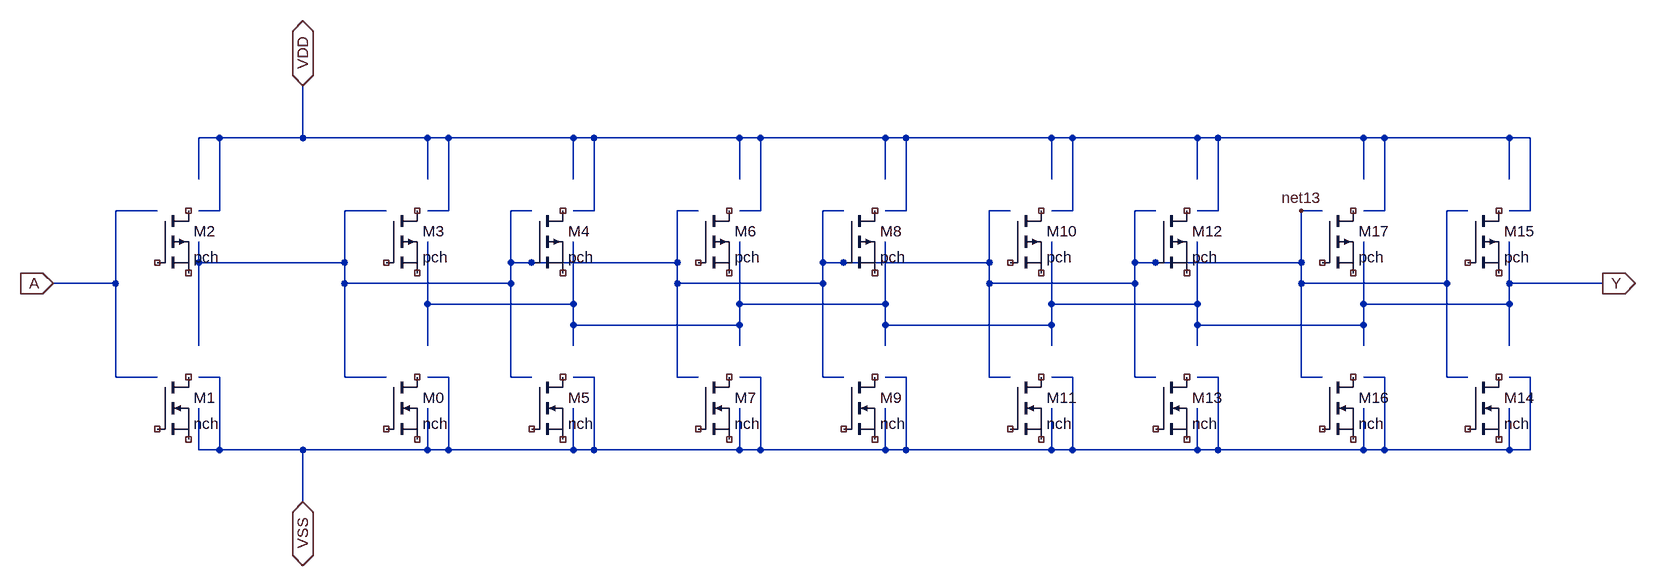
[diagram p0: schematic buf8.asc]
buf8.asc, the LTspice schematic file:
Version 4
SHEET 1 2560 832
WIRE 192 544 192 400
WIRE 96 400 192 400
WIRE 192 400 192 288
WIRE 192 288 256 288
WIRE 192 544 256 544
WIRE 2016 544 2016 400
WIRE 1760 368 1760 288
WIRE 2016 368 2016 288
WIRE 2016 288 2048 288
WIRE 2016 400 2016 368
WIRE 2016 544 2048 544
WIRE 2240 400 2240 288
WIRE 2240 288 2272 288
WIRE 2240 544 2272 544
WIRE 2240 544 2240 400
WIRE 1760 368 2016 368
WIRE 2016 400 2240 400
WIRE 1536 544 1536 400
WIRE 1280 368 1280 288
WIRE 1536 368 1536 288
WIRE 1536 288 1568 288
WIRE 1536 400 1536 368
WIRE 1536 544 1568 544
WIRE 1760 400 1760 368
WIRE 1760 288 1792 288
WIRE 1760 544 1792 544
WIRE 1760 544 1760 400
WIRE 1280 368 1536 368
WIRE 1056 400 1280 400
WIRE 1056 544 1056 400
WIRE 1280 400 1280 368
WIRE 1536 400 1760 400
WIRE 1280 288 1312 288
WIRE 1280 544 1312 544
WIRE 1280 544 1280 400
WIRE 320 496 320 368
WIRE 544 400 544 368
WIRE 800 288 832 288
WIRE 800 544 832 544
WIRE 1056 368 1056 288
WIRE 800 368 800 288
WIRE 800 368 1056 368
WIRE 1056 288 1088 288
WIRE 1056 400 1056 368
WIRE 1056 544 1088 544
WIRE 800 400 800 368
WIRE 544 400 800 400
WIRE 544 544 544 400
WIRE 800 544 800 400
WIRE 544 288 608 288
WIRE 320 368 320 336
WIRE 544 544 608 544
WIRE 544 368 544 288
WIRE 320 368 544 368
WIRE 2336 400 2336 336
WIRE 2112 432 2112 336
WIRE 2112 464 2112 432
WIRE 2112 496 2112 464
WIRE 1856 464 1856 432
WIRE 2336 432 2336 400
WIRE 2336 496 2336 432
WIRE 1632 432 1856 432
WIRE 1632 432 1632 336
WIRE 1632 464 1632 432
WIRE 1632 496 1632 464
WIRE 1856 464 2112 464
WIRE 1376 464 1376 432
WIRE 1856 432 1856 336
WIRE 2112 432 2336 432
WIRE 1856 496 1856 464
WIRE 1376 432 1376 336
WIRE 1152 432 1152 336
WIRE 1152 432 1376 432
WIRE 896 464 1152 464
WIRE 896 496 896 464
WIRE 1152 464 1152 432
WIRE 1152 496 1152 464
WIRE 1376 496 1376 464
WIRE 672 432 672 336
WIRE 672 432 896 432
WIRE 896 432 896 336
WIRE 896 464 896 432
WIRE 2336 400 2480 400
WIRE 672 496 672 432
WIRE 1376 464 1632 464
WIRE 2144 656 2336 656
WIRE 1888 656 2112 656
WIRE 1664 656 1856 656
WIRE 1408 656 1632 656
WIRE 2112 656 2144 656
WIRE 2144 656 2144 544
WIRE 2112 544 2144 544
WIRE 2112 656 2112 592
WIRE 2336 656 2368 656
WIRE 2368 656 2368 544
WIRE 2336 544 2368 544
WIRE 2336 656 2336 592
WIRE 1632 656 1664 656
WIRE 1664 656 1664 544
WIRE 1632 544 1664 544
WIRE 1632 656 1632 592
WIRE 1856 656 1888 656
WIRE 1888 656 1888 544
WIRE 1856 544 1888 544
WIRE 1856 656 1856 592
WIRE 928 656 1152 656
WIRE 1184 656 1376 656
WIRE 1152 656 1184 656
WIRE 1184 656 1184 544
WIRE 1152 544 1184 544
WIRE 1152 656 1152 592
WIRE 1376 656 1408 656
WIRE 1408 656 1408 544
WIRE 1376 544 1408 544
WIRE 1376 656 1376 592
WIRE 704 656 896 656
WIRE 896 656 928 656
WIRE 928 656 928 544
WIRE 896 544 928 544
WIRE 896 656 896 592
WIRE 480 656 480 736
WIRE 480 656 672 656
WIRE 352 656 352 544
WIRE 352 656 480 656
WIRE 320 544 352 544
WIRE 672 656 704 656
WIRE 704 656 704 544
WIRE 672 544 704 544
WIRE 672 656 672 592
WIRE 320 656 352 656
WIRE 320 656 320 592
WIRE 2144 176 2336 176
WIRE 1888 176 2112 176
WIRE 1664 176 1856 176
WIRE 1408 176 1632 176
WIRE 2112 176 2144 176
WIRE 2144 288 2144 176
WIRE 2112 288 2144 288
WIRE 2112 240 2112 176
WIRE 2336 176 2368 176
WIRE 2368 288 2368 176
WIRE 2336 288 2368 288
WIRE 2336 240 2336 176
WIRE 1632 176 1664 176
WIRE 1664 288 1664 176
WIRE 1632 288 1664 288
WIRE 1632 240 1632 176
WIRE 1856 176 1888 176
WIRE 1888 288 1888 176
WIRE 1856 288 1888 288
WIRE 1856 240 1856 176
WIRE 1152 176 1184 176
WIRE 1184 288 1184 176
WIRE 1152 288 1184 288
WIRE 1152 240 1152 176
WIRE 1376 176 1408 176
WIRE 1408 288 1408 176
WIRE 1376 288 1408 288
WIRE 1376 240 1376 176
WIRE 1184 176 1376 176
WIRE 704 176 896 176
WIRE 896 176 928 176
WIRE 928 176 1152 176
WIRE 928 288 928 176
WIRE 896 288 928 288
WIRE 896 240 896 176
WIRE 480 96 480 176
WIRE 480 176 672 176
WIRE 672 176 704 176
WIRE 704 288 704 176
WIRE 672 288 704 288
WIRE 352 288 352 176
WIRE 352 176 480 176
WIRE 320 288 352 288
WIRE 672 240 672 176
WIRE 320 176 352 176
WIRE 320 240 320 176
FLAG 2016 288 net13
SYMBOL PMOS 2048 288 R0
SYMATTR InstName M17
SYMATTR Value pch
SYMATTR Value2 w=6u l=1u
SYMBOL PMOS 2272 288 R0
SYMATTR InstName M15
SYMATTR Value pch
SYMATTR Value2 w=6u l=1u
SYMBOL PMOS 1792 288 R0
SYMATTR InstName M12
SYMATTR Value pch
SYMATTR Value2 w=6u l=1u
SYMBOL PMOS 1568 288 R0
SYMATTR InstName M10
SYMATTR Value pch
SYMATTR Value2 w=6u l=1u
SYMBOL PMOS 1312 288 R0
SYMATTR InstName M8
SYMATTR Value pch
SYMATTR Value2 w=6u l=1u
SYMBOL PMOS 1088 288 R0
SYMATTR InstName M6
SYMATTR Value pch
SYMATTR Value2 w=6u l=1u
SYMBOL PMOS 832 288 R0
SYMATTR InstName M4
SYMATTR Value pch
SYMATTR Value2 w=6u l=1u
SYMBOL PMOS 608 288 R0
SYMATTR InstName M3
SYMATTR Value pch
SYMATTR Value2 w=6u l=1u
SYMBOL PMOS 256 288 R0
SYMATTR InstName M2
SYMATTR Value pch
SYMATTR Value2 w=6u l=1u
SYMBOL NMOS 2048 544 R0
SYMATTR InstName M16
SYMATTR Value nch
SYMATTR Value2 w=2u l=1u
SYMBOL NMOS 2272 544 R0
SYMATTR InstName M14
SYMATTR Value nch
SYMATTR Value2 w=2u l=1u
SYMBOL NMOS 1792 544 R0
SYMATTR InstName M13
SYMATTR Value nch
SYMATTR Value2 w=2u l=1u
SYMBOL NMOS 1568 544 R0
SYMATTR InstName M11
SYMATTR Value nch
SYMATTR Value2 w=2u l=1u
SYMBOL NMOS 1312 544 R0
SYMATTR InstName M9
SYMATTR Value nch
SYMATTR Value2 w=2u l=1u
SYMBOL NMOS 1088 544 R0
SYMATTR InstName M7
SYMATTR Value nch
SYMATTR Value2 w=2u l=1u
SYMBOL NMOS 832 544 R0
SYMATTR InstName M5
SYMATTR Value nch
SYMATTR Value2 w=2u l=1u
SYMBOL NMOS 256 544 R0
SYMATTR InstName M1
SYMATTR Value nch
SYMATTR Value2 w=2u l=1u
SYMBOL NMOS 608 544 R0
SYMATTR InstName M0
SYMATTR Value nch
SYMATTR Value2 w=2u l=1u
FLAG 2480 400 Y
IOPIN 2480 400 Out
FLAG 480 736 VSS
IOPIN 480 736 BiDir
FLAG 480 96 VDD
IOPIN 480 96 BiDir
FLAG 96 400 A
IOPIN 96 400 In

The netlist it stands for:
* buf8.asc
* M17: pch w=6u l=1u (symbol PMOS not certain, pin order unknown); nets seen at it: 
* M15: pch w=6u l=1u (symbol PMOS not certain, pin order unknown); nets seen at it: 
* M12: pch w=6u l=1u (symbol PMOS not certain, pin order unknown); nets seen at it: net13
* M10: pch w=6u l=1u (symbol PMOS not certain, pin order unknown); nets seen at it: 
* M8: pch w=6u l=1u (symbol PMOS not certain, pin order unknown); nets seen at it: net13
* M6: pch w=6u l=1u (symbol PMOS not certain, pin order unknown); nets seen at it: 
* M4: pch w=6u l=1u (symbol PMOS not certain, pin order unknown); nets seen at it: net13
* M3: pch w=6u l=1u (symbol PMOS not certain, pin order unknown); nets seen at it: 
* M2: pch w=6u l=1u (symbol PMOS not certain, pin order unknown); nets seen at it: 
* M16: nch w=2u l=1u (symbol NMOS not certain, pin order unknown); nets seen at it: 
* M14: nch w=2u l=1u (symbol NMOS not certain, pin order unknown); nets seen at it: 
* M13: nch w=2u l=1u (symbol NMOS not certain, pin order unknown); nets seen at it: 
* M11: nch w=2u l=1u (symbol NMOS not certain, pin order unknown); nets seen at it: 
* M9: nch w=2u l=1u (symbol NMOS not certain, pin order unknown); nets seen at it: 
* M7: nch w=2u l=1u (symbol NMOS not certain, pin order unknown); nets seen at it: 
* M5: nch w=2u l=1u (symbol NMOS not certain, pin order unknown); nets seen at it: 
* M1: nch w=2u l=1u (symbol NMOS not certain, pin order unknown); nets seen at it: 
* M0: nch w=2u l=1u (symbol NMOS not certain, pin order unknown); nets seen at it: 
.backanno
.end